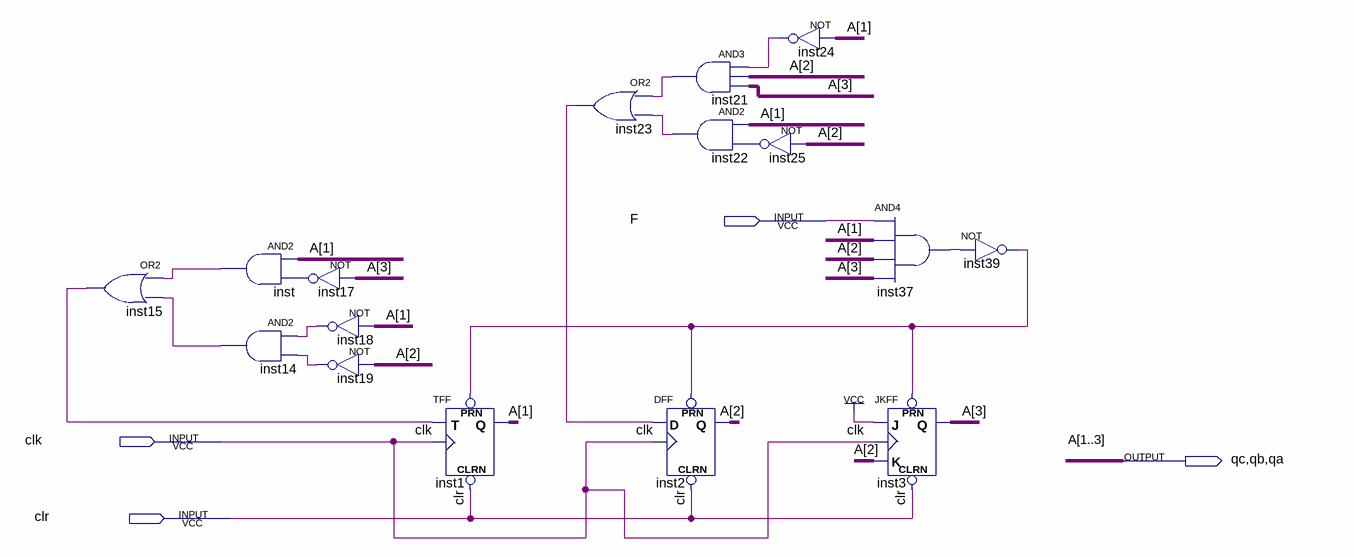
[diagram p0: schematic sheet]
// Quartus schematic contador.bdf as structural Verilog: 16 symbols, 4 pins
module contador (
  input  F,
  input  clk,
  input  clr,
  output qc,
  output qb,
  output qa
);

  wire inst14_out, inst15_out, inst17_out, inst18_out, inst19_out, inst21_out, inst22_out, inst23_out,
       inst24_out, inst25_out, inst37_out, inst39_out, inst_out;

  or inst15 (inst15_out, inst_out, inst14_out);
  and inst (inst_out, qc, inst17_out);
  and inst14 (inst14_out, inst18_out, inst19_out);
  not inst17 (inst17_out, qa);
  not inst18 (inst18_out, qc);
  not inst19 (inst19_out, qb);
  TFF inst1 (.PRN(inst39_out), .CLRN(clr), .T(inst15_out), .CLK(clk), .Q(qc));
  or inst23 (inst23_out, inst21_out, inst22_out);
  and inst21 (inst21_out, inst24_out, qb, qa);
  and inst22 (inst22_out, qc, inst25_out);
  DFF inst2 (.CLRN(clr), .CLK(clk), .D(inst23_out), .PRN(inst39_out), .Q(qb));
  not inst25 (inst25_out, qb);
  not inst24 (inst24_out, qc);
  and inst37 (inst37_out, F, qc, qb, qa);
  JKFF inst3 (.PRN(inst39_out), .CLRN(clr), .K(qb), .J(1'b1), .CLK(clk), .Q(qa));
  not inst39 (inst39_out, inst37_out);

  // Other names for the same wires on the sheet: A[3:1] = {qa, qb, qc}
endmodule
